# EAGLE design attiny_shield (EAGLE 8.3.2)
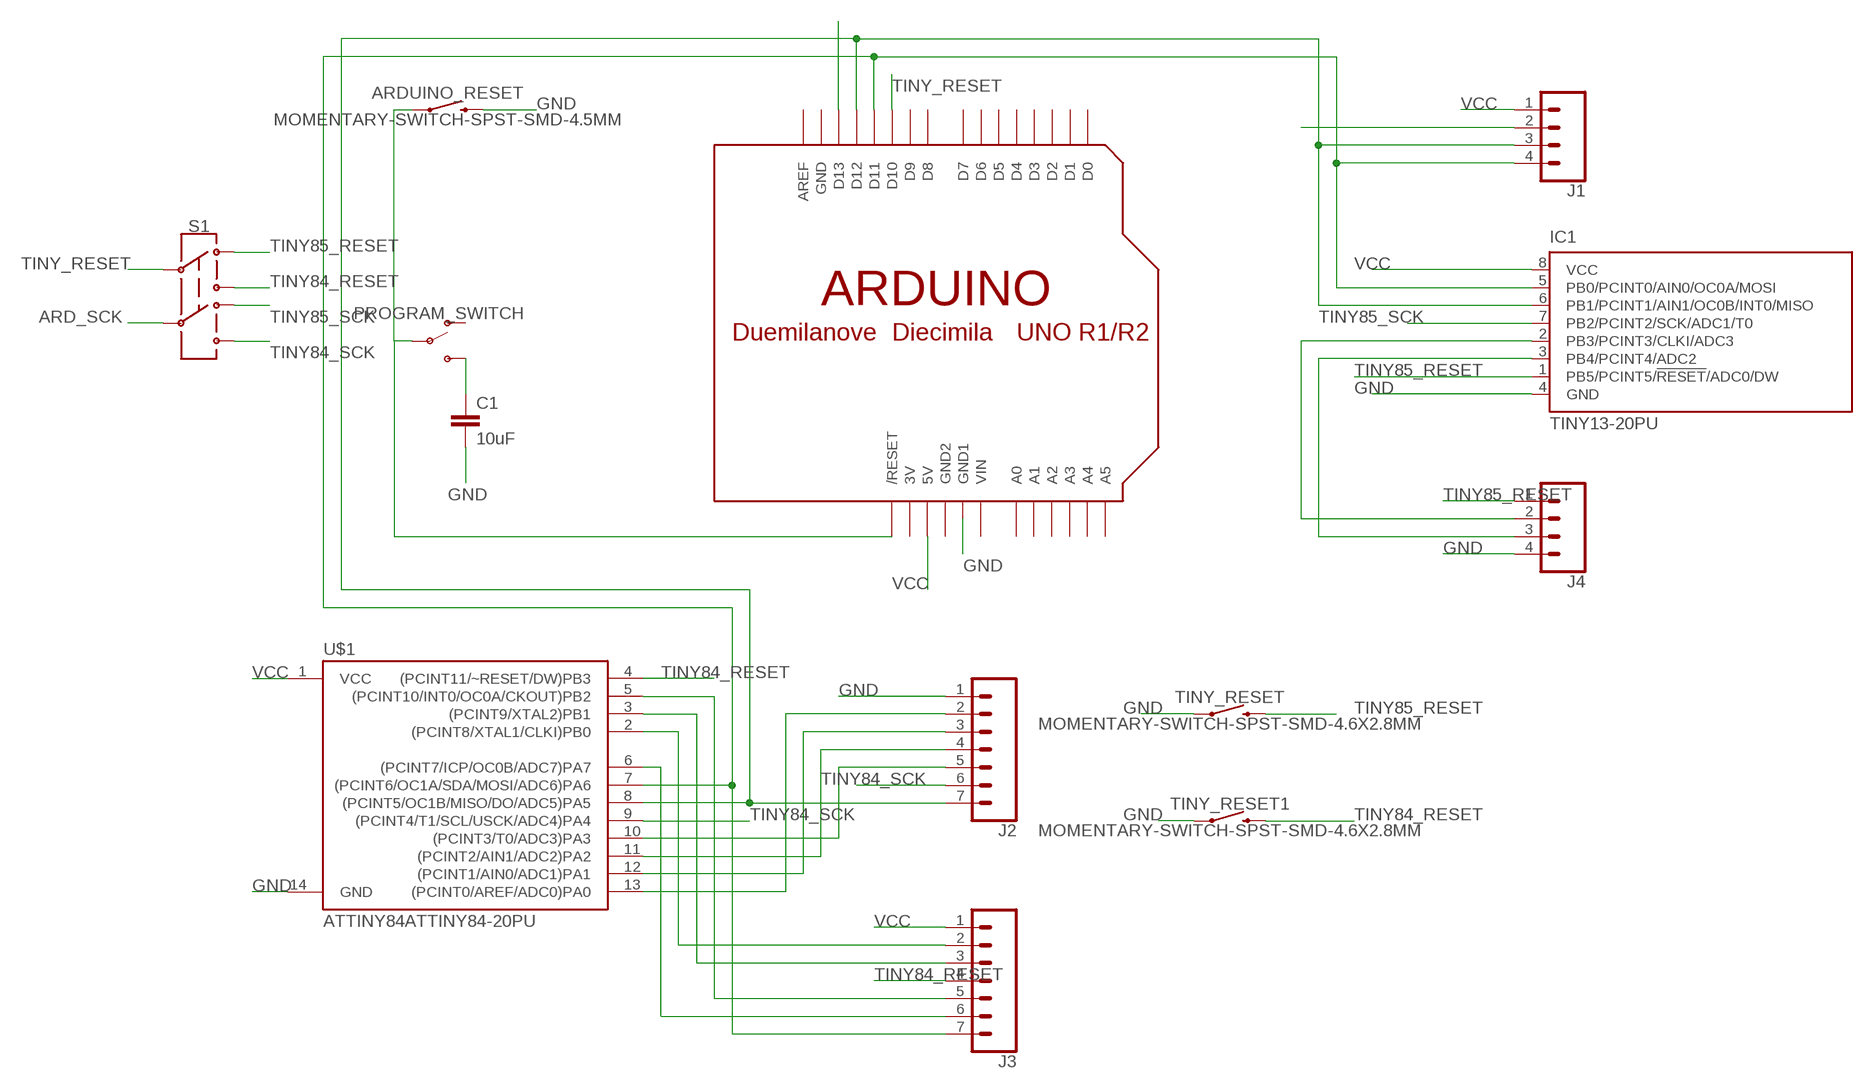
[diagram p0: schematic, sheet 1]

## Parts
ARDUINO_RESET  MOMENTARY-SWITCH-SPST-SMD-4.5MM  [TACTILE_SWITCH_SMD_4.5MM]
C1  10uF  10UF-0805-10V-10%  [0805]
IC1  TINY13-20PU  [DIL08]
J1  CONN_04  [1X04]
J2  CONN_07  [1X07]
J3  CONN_07  [1X07]
J4  CONN_04  [1X04]
PROGRAM_SWITCH  SWITCH-SPDT-SMD-AYZ0202  [SWITCH_DPDT_SMD_AYZ0202]
S1  SWITCH-DPDT-SMD-AYZ0202  [SWITCH_DPDT_SMD_AYZ0202]
TINY_RESET  MOMENTARY-SWITCH-SPST-SMD-4.6X2.8MM  [TACTILE_SWITCH_SMD_4.6X2.8MM]
TINY_RESET1  MOMENTARY-SWITCH-SPST-SMD-4.6X2.8MM  [TACTILE_SWITCH_SMD_4.6X2.8MM]
U$1  ATTINY84ATTINY84-20PU  [DIP14]
U$2  ARDUINO-NODIM  [ARDUINO-NODIM]

## Nets
84_0: J2.2 U$1.13((PCINT0/AREF/ADC0)PA0)
84_1: J2.3 U$1.12((PCINT1/AIN0/ADC1)PA1)
84_5: IC1.6(PB1/PCINT1/AIN1/OC0B/INT0/MISO) J1.3 J2.7 U$1.8((PCINT5/OC1B/MISO/DO/ADC5)PA5) U$2.D12
84_6: IC1.5(PB0/PCINT0/AIN0/OC0A/MOSI) J1.4 J3.7 U$1.7((PCINT6/OC1A/SDA/MOSI/ADC6)PA6) U$2.D11
ARD_SCK: S1.5 U$2.D13
GND: ARDUINO_RESET.1 ARDUINO_RESET.4 C1.2 IC1.4(GND) J2.1 J4.4 TINY_RESET1.1 TINY_RESET1.2 TINY_RESET.1 TINY_RESET.2 U$1.14(GND)
N$2: IC1.2(PB3/PCINT3/CLKI/ADC3) J4.2
N$3: IC1.3(PB4/PCINT4/ADC2) J4.3
N$9: C1.1 PROGRAM_SWITCH.3(S)
N$10: ARDUINO_RESET.2 ARDUINO_RESET.3 PROGRAM_SWITCH.2(P) U$2.RESET(/RESET)
N$14: J2.4 U$1.11((PCINT2/AIN1/ADC2)PA2)
N$15: J2.5 U$1.10((PCINT3/T0/ADC3)PA3)
N$17: J3.6 U$1.6((PCINT7/ICP/OC0B/ADC7)PA7)
N$18: J3.2 U$1.2((PCINT8/XTAL1/CLKI)PB0)
N$19: J3.3 U$1.3((PCINT9/XTAL2)PB1)
N$20: J3.5 U$1.5((PCINT10/INT0/OC0A/CKOUT)PB2)
TINY84_RESET: J3.4 S1.3 TINY_RESET1.3 TINY_RESET1.4 U$1.4((PCINT11/~RESET/DW)PB3)
TINY84_SCK: J2.6 S1.6 U$1.9((PCINT4/T1/SCL/USCK/ADC4)PA4)
TINY85_RESET: IC1.1(PB5/PCINT5/!RESET!/ADC0/DW) J4.1 S1.1 TINY_RESET.3 TINY_RESET.4
TINY85_SCK: IC1.7(PB2/PCINT2/SCK/ADC1/T0) J1.2 S1.4
TINY_RESET: S1.2 U$2.D10
VCC: IC1.8(VCC) J1.1 J3.1 U$1.1(VCC) U$2.5V
Unconnected: PROGRAM_SWITCH.1(O) U$2.A0 U$2.A1 U$2.A2 U$2.A3 U$2.A4 U$2.A5 U$2.AREF U$2.D0 U$2.D1 U$2.D2 U$2.D3 U$2.D4 U$2.D5 U$2.D6 U$2.D7 U$2.D8 U$2.D9

## Power pins joined to a net without a drawn wire
3V: U$2.3V
GND: U$2.GND
GND1: U$2.GND1
GND2: U$2.GND2
VIN: U$2.VIN

## Library data of the parts
ARDUINO_RESET = SparkFun-Switches:MOMENTARY-SWITCH-SPST: Momentary Switch (Pushbutton) - SPST Normally-open (NO) SPST momentary switches (buttons, pushbuttons). Variants PTH-12MM - 12mm square, through-hole Momentary Pushbutton Switch - 12mm Square <https://www.sparkfun.com/products/9190> (COM-09190) PTH-6.0MM, PTH-6.0MM-KIT - 6.0mm square, through-hole Mini Pushbutton Switch <https://www.sparkfun.com/products/97> (COM-00097) KIT package intended for soldering kit's - only one side of pads' copper is exposed. PTH-RIGHT-ANGLE-KIT - Right-angle, through-hole Right Angle Tactile Button <https://www.sparkfun.com/products/10791> - Used on SparkFun BigTime Watch Kit <https://www.sparkfun.com/products/11734> SMD-12MM - 12mm square, surface-mount Tactile Button - SMD (12mm) <https://www.sparkfun.com/products/12993> (COM-12993) Used on SparkFun PicoBoard <https://www.sparkfun.com/products/11888> SMD-4.5MM - 4.5mm Square Trackball Switch Used on SparkFun Blackberry Trackballer Breakout <https://www.sparkfun.com/products/13169> SMD-4.6MMX2.8MM - 4.60mm x 2.80mm, surface mount Used on SparkFun SAMD21 Mini Breakout <https://www.sparkfun.com/products/13664> SMD-5.2MM, SMD-5.2-REDUNDANT - 5.2mm square, surface-mount Mini Pushbutton Switch - SMD <https://www.sparkfun.com/products/8720> (COM-08720) Used on Arduino Pro Mini <https://www.sparkfun.com/products/11114> REDUNDANT package connects both switch circuits together SMD-6.0X3.5MM - 6.0 x 3.5mm, surface mount Momentary Reset Switch SMD <https://www.sparkfun.com/products/8229> (COM-08229) SMD-6.2MM-TALL - 6.2mm square, surface mount Tactile Button - SMD (6mm) <https://www.sparkfun.com/products/12992> Used on SparkFun Digital Sandbox <https://www.sparkfun.com/products/12651> SMD-RIGHT-ANGLE - Right-angle, surface mount Used on SparkFun Block for Intel® Edison - Arduino <https://www.sparkfun.com/products/13036>; PROD_ID: SWCH-09213
C1 = SparkFun-Capacitors:10UF: 10.0µF ceramic capacitors A capacitor is a passive two-terminal electrical component used to store electrical energy temporarily in an electric field.; PROD_ID: CAP-11330
IC1 = atmel:TINY13: 8-bit AVR Microcontroller with 1K Bytes In-System Programmable Flash Source: http://www.atmel.com/dyn/resources/prod_documents/2535S.pdf; MPN: ATTINY13-20PU; OC_FARNELL: 9171550; OC_NEWARK: 96K6521
J1 J4 = SparkFun-Connectors:CONN_04: Multi connection point. Often used as Generic Header-pin footprint for 0.1 inch spaced/style header connections On any of the 0.1 inch spaced packages, you can populate with these: Break Away Headers - Straight <https://www.sparkfun.com/products/116> (PRT-00116) Break Away Male Headers - Right Angle <https://www.sparkfun.com/products/553> (PRT-00553) Female Headers <https://www.sparkfun.com/products/115> (PRT-00115) Break Away Headers - Machine Pin <https://www.sparkfun.com/products/117> (PRT-00117) Break Away Female Headers - Swiss Machine Pin <https://www.sparkfun.com/products/743> (PRT-00743) For SCREWTERMINALS and SPRING TERMINALS visit here: Screw Terimnals on SparkFun.com <https://www.sparkfun.com/search/results?term=Screw+Terminals> (5mm/3.5mm/2.54mm spacing) This device is also useful as a general connection point to wire up your design to another part of your project. Our various solder wires solder well into these plated through hole pads. Hook-Up Wire - Assortment (Stranded, 22 AWG) <https://www.sparkfun.com/products/11375> (PRT-11375) Hook-Up Wire - Assortment (Solid Core, 22 AWG) <https://www.sparkfun.com/products/11367> (PRT-11367) View the entire wire category on our website here <https://www.sparkfun.com/categories/141> Special notes: Molex polarized connector foot print use with SKU : PRT-08231 with associated crimp pins and housings. 1MM SMD Version SKU: PRT-10208; PROD_ID: CONN-09696
J2 J3 = SparkFun-Connectors:CONN_07: Multi connection point. Often used as Generic Header-pin footprint for 0.1 inch spaced/style header connections On any of the 0.1 inch spaced packages, you can populate with these: Break Away Headers - Straight <https://www.sparkfun.com/products/116> (PRT-00116) Break Away Male Headers - Right Angle <https://www.sparkfun.com/products/553> (PRT-00553) Female Headers <https://www.sparkfun.com/products/115> (PRT-00115) Break Away Headers - Machine Pin <https://www.sparkfun.com/products/117> (PRT-00117) Break Away Female Headers - Swiss Machine Pin <https://www.sparkfun.com/products/743> (PRT-00743) For SCREWTERMINALS and SPRING TERMINALS visit here: Screw Terimnals on SparkFun.com <https://www.sparkfun.com/search/results?term=Screw+Terminals> (5mm/3.5mm/2.54mm spacing) This device is also useful as a general connection point to wire up your design to another part of your project. Our various solder wires solder well into these plated through hole pads. Hook-Up Wire - Assortment (Stranded, 22 AWG) <https://www.sparkfun.com/products/11375> (PRT-11375) Hook-Up Wire - Assortment (Solid Core, 22 AWG) <https://www.sparkfun.com/products/11367> (PRT-11367) View the entire wire category on our website here <https://www.sparkfun.com/categories/141> Special notes: Molex polarized connector foot print use with SKU : PRT-08231 with associated crimp pins and housings. 1MM SMD Version SKU: PRT-10208 NOTES ON THE VARIANTS LOCK and LOCK_LONGPADS... This footprint was designed to help hold the alignment of a through-hole component (i.e. 6-pin header) while soldering it into place. You may notice that each hole has been shifted either up or down by 0.005 of an inch from it's more standard position (which is a perfectly straight line). This slight alteration caused the pins (the squares in the middle) to touch the edges of the holes. Because they are alternating, it causes a "brace" to hold the component in place. 0.005 has proven to be the perfect amount of "off-center" position when using our standard breakaway headers. Although looks a little odd when you look at the bare footprint, once you have a header in there, the alteration is very hard to notice. Also,if you push a header all the way into place, it is covered up entirely on the bottom side.
PROGRAM_SWITCH = SparkFun-Switches:SWITCH-SPDT: Single Pole, Double Throw (SPDT) Switch Single-pole, double-throw (SPDT) switch. Variant Overview SMD-AYZ0202 Surface Mount DPDT Switch <https://www.sparkfun.com/products/597> (COM-00597) Used on e.g. LilyPad Arduino USB - ATmega32U4 Board <https://www.sparkfun.com/products/12049> PTH-11.6X4.0MM SPDT Mini Power Switch <https://www.sparkfun.com/products/102> (COM-00102) Used on e.g. SparkFun Simon Says - Through-Hole Soldering Kit <https://www.sparkfun.com/products/10547> (KIT-10547) PTH-11.6X4.0MM-KIT KIT version of SPDT Mini Power Switch - Simplifies soldering by removing tStop of switch pins - only one side can be soldered. PTH-11.6X4.0MM-LOCK LOCK version of SPDT Mini Power Switch - Offset pins hold switch in place for easier soldering. SMD-RIGHT-ANGLE Surface Mount Right Angle Switch <https://www.sparkfun.com/products/10860> (COM-10860) Used on e.g. SparkFun ESP8266 Thing <https://www.sparkfun.com/products/13231>; PROD_ID: SWCH-08179; SF_ID: COM-00597
S1 = SparkFun-Switches:SWITCH-DPDT: Double-Pole, Double-Throw (DPDT) Switch Double-pole, double-throw switches. Variant Overview PTH-GPI-152-3013 Used on SparkFun Geiger Counter <https://www.sparkfun.com/products/11345> SMD-AY0202 Surface Mount DPDT Switch <https://www.sparkfun.com/products/597> (COM-00597) Used on e.g. LilyPad Arduino USB - ATmega32U4 Board <https://www.sparkfun.com/products/12049>; PROD_ID: SWCH-08179; SF_SKU: COM-00597
TINY_RESET TINY_RESET1 = SparkFun-Switches:MOMENTARY-SWITCH-SPST: Momentary Switch (Pushbutton) - SPST Normally-open (NO) SPST momentary switches (buttons, pushbuttons). Variants PTH-12MM - 12mm square, through-hole Momentary Pushbutton Switch - 12mm Square <https://www.sparkfun.com/products/9190> (COM-09190) PTH-6.0MM, PTH-6.0MM-KIT - 6.0mm square, through-hole Mini Pushbutton Switch <https://www.sparkfun.com/products/97> (COM-00097) KIT package intended for soldering kit's - only one side of pads' copper is exposed. PTH-RIGHT-ANGLE-KIT - Right-angle, through-hole Right Angle Tactile Button <https://www.sparkfun.com/products/10791> - Used on SparkFun BigTime Watch Kit <https://www.sparkfun.com/products/11734> SMD-12MM - 12mm square, surface-mount Tactile Button - SMD (12mm) <https://www.sparkfun.com/products/12993> (COM-12993) Used on SparkFun PicoBoard <https://www.sparkfun.com/products/11888> SMD-4.5MM - 4.5mm Square Trackball Switch Used on SparkFun Blackberry Trackballer Breakout <https://www.sparkfun.com/products/13169> SMD-4.6MMX2.8MM - 4.60mm x 2.80mm, surface mount Used on SparkFun SAMD21 Mini Breakout <https://www.sparkfun.com/products/13664> SMD-5.2MM, SMD-5.2-REDUNDANT - 5.2mm square, surface-mount Mini Pushbutton Switch - SMD <https://www.sparkfun.com/products/8720> (COM-08720) Used on Arduino Pro Mini <https://www.sparkfun.com/products/11114> REDUNDANT package connects both switch circuits together SMD-6.0X3.5MM - 6.0 x 3.5mm, surface mount Momentary Reset Switch SMD <https://www.sparkfun.com/products/8229> (COM-08229) SMD-6.2MM-TALL - 6.2mm square, surface mount Tactile Button - SMD (6mm) <https://www.sparkfun.com/products/12992> Used on SparkFun Digital Sandbox <https://www.sparkfun.com/products/12651> SMD-RIGHT-ANGLE - Right-angle, surface mount Used on SparkFun Block for Intel® Edison - Arduino <https://www.sparkfun.com/products/13036>; PROD_ID: SWCH-13065
U$1 = SparkFun-IC-Microcontroller:ATTINY84: Atmel 14-pin 2/4/8kB flash uC Datasheet <https://cdn.sparkfun.com/datasheets/Widgets/doc8006.pdf> SparkFun Products Tiny AVR Programmer <https://www.sparkfun.com/products/11801> (PGM-11801) SparkFun Servo Trigger - Continuous Rotation <https://www.sparkfun.com/products/13872> (WIG-13872) SparkFun Servo Trigger <https://www.sparkfun.com/products/13118> (WIG-13118)
U$2 = adafruit:ARDUINO: Arduino Diecimila/Duemilanove Make a shield with ease, this package has all the named pins as well as the two mounting drill holes and an outline of the USB and DC power connector. The outline is on the DIMENSION layer, so if your board house uses it they will cut the outline to match. http://www.ladyada.net/library/pcb/eaglelibrary.html

## Board
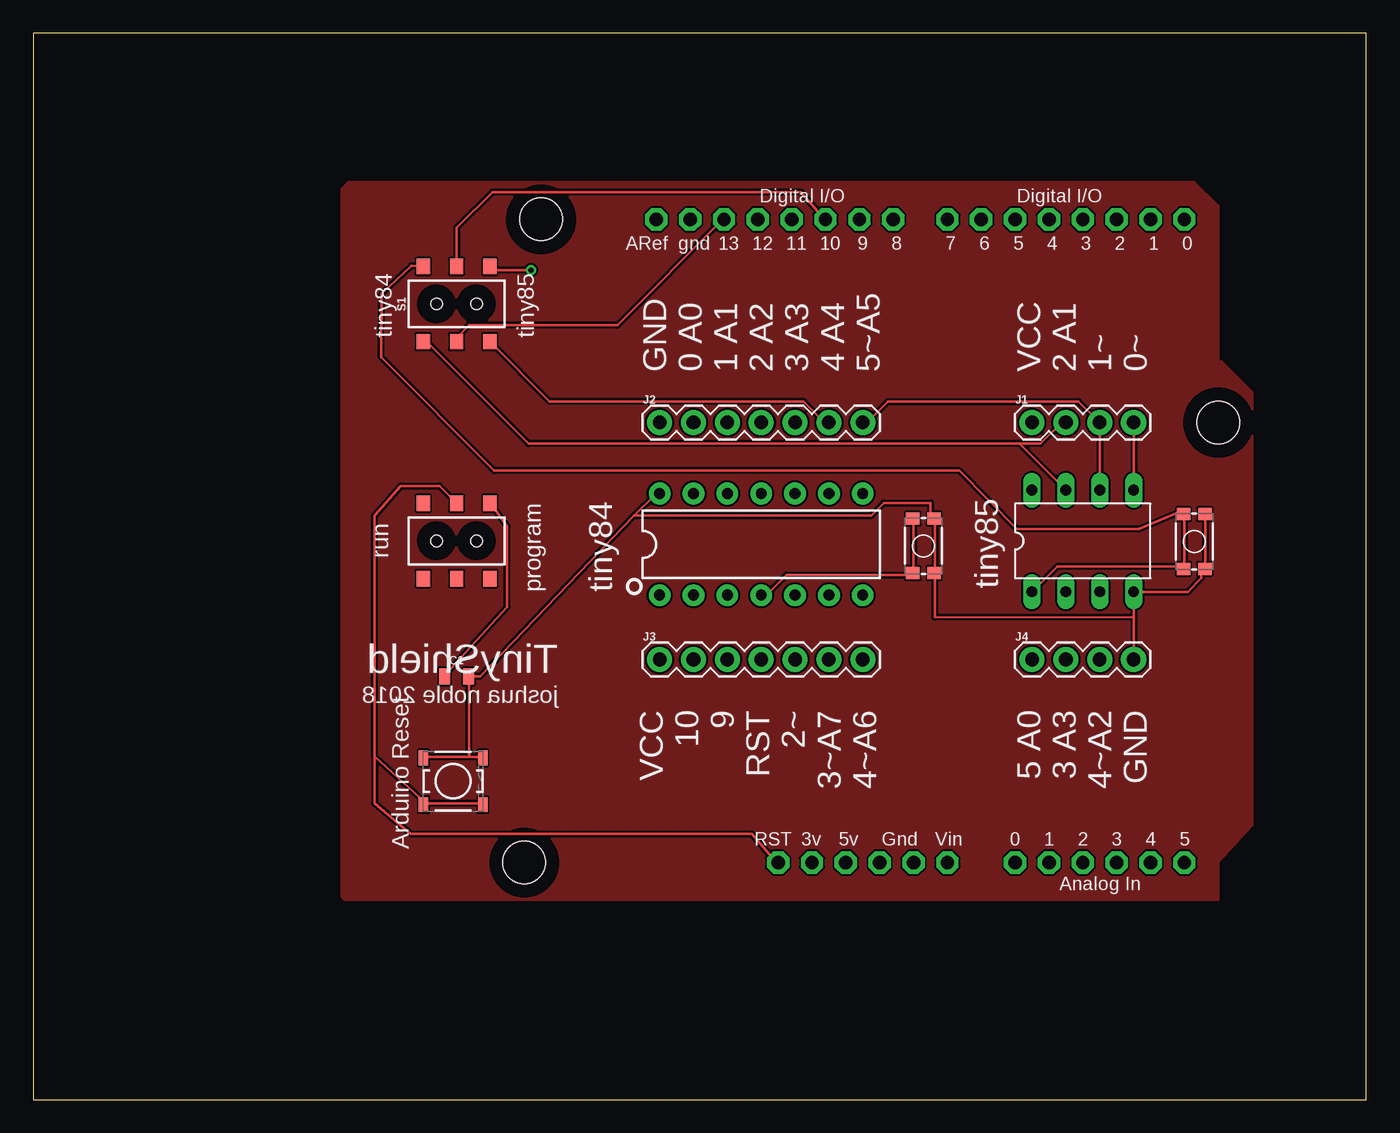
[diagram p1: board, top side]
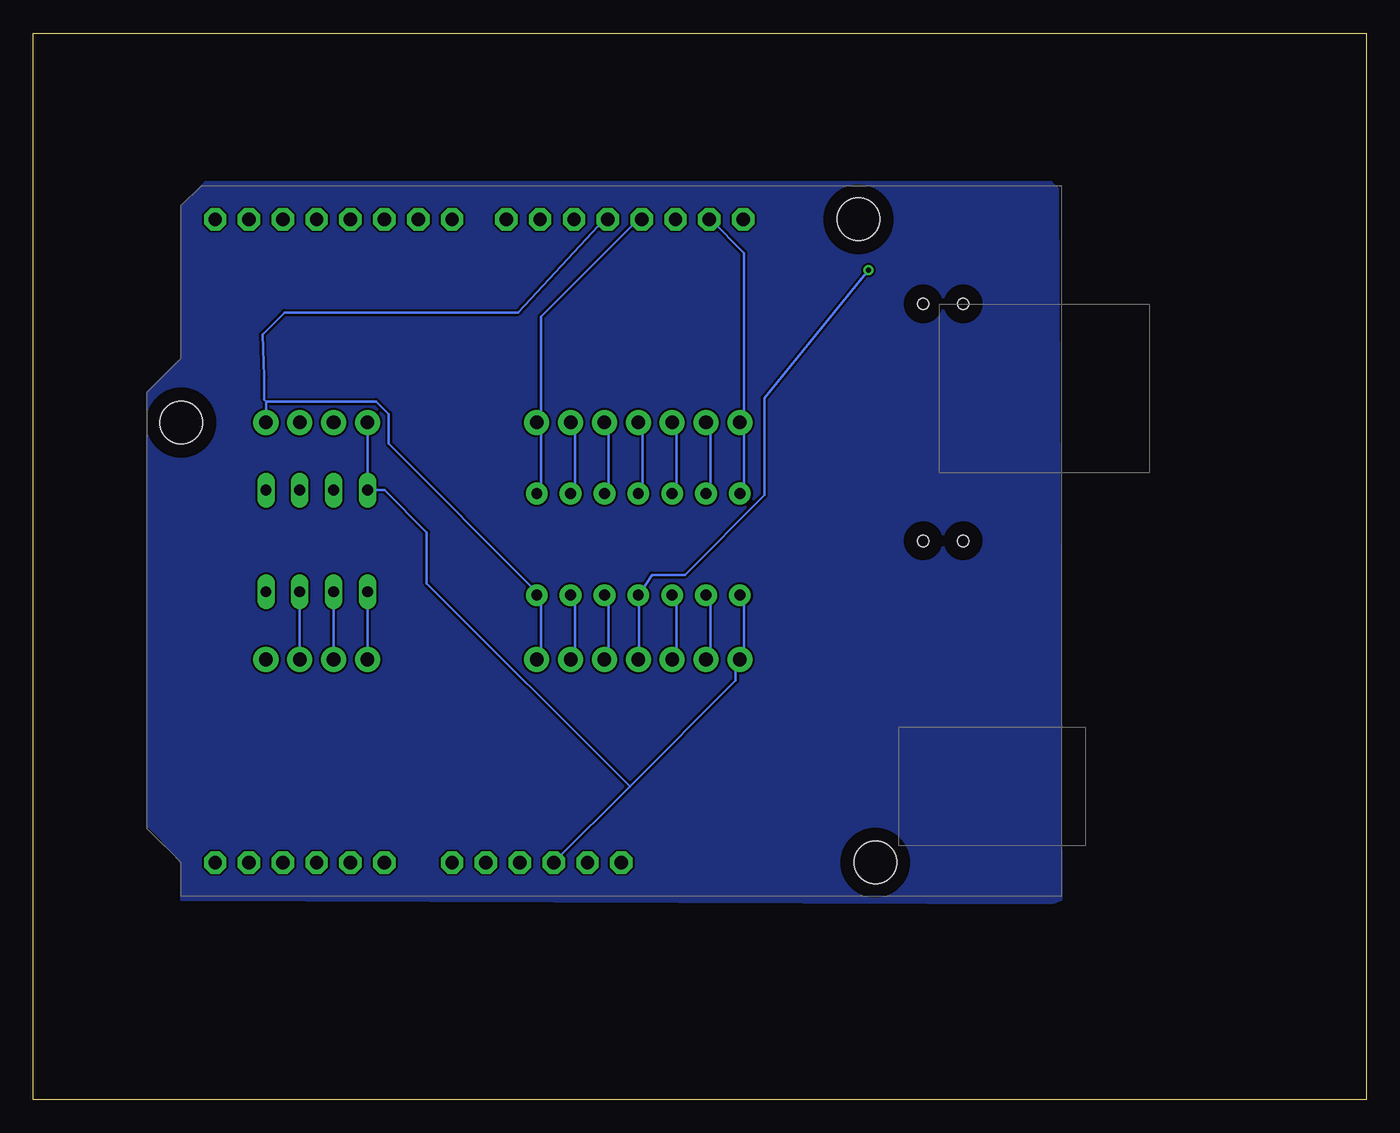
[diagram p2: board, bottom side, seen from below]

Size 100 x 80 mm. Coordinates in mm from the lower left corner, seen from the top.
Outline: 0,0 100,0 100,80 0,80 0,0
Copper layers (1*16): Top 0.035mm / dielectric 1.5mm / Bottom 0.035mm
Design rules "default": minimum track width 6mil, minimum drill 0.35mm, track to track 6mil, track to pad 6mil, pad to pad 6mil, via to via 6mil, smd to smd 6mil, copper to edge 40mil, drill to drill 6mil, minimum pad ring 10mil, minimum via ring 8mil, stop-mask expansion 4mil, vias tented up to drill 0mil, thermal gap 10mil

### Footprints (pad centres in the part's own frame; a part is rotated, then mirrored left to right if it is on the bottom)
TACTILE_SWITCH_SMD_4.5MM = smd 0.7 x 1.1: 1 2.225,1.75; 2 2.225,-1.75; 3 -2.225,-1.75; 4 -2.225,1.75
0805 = smd 0.8 x 1.2: 1 -0.9,0; 2 0.9,0
DIL08 = drill 0.813 long: 1 -3.81,-3.81; 2 -1.27,-3.81; 3 1.27,-3.81; 4 3.81,-3.81; 5 3.81,3.81; 6 1.27,3.81; 7 -1.27,3.81; 8 -3.81,3.81
1X04 = drill 1.016 pad 1.88: 1 0,0; 2 2.54,0; 3 5.08,0; 4 7.62,0
1X07 = drill 1.016 pad 1.88: 1 0,0; 2 2.54,0; 3 5.08,0; 4 7.62,0; 5 10.16,0; 6 12.7,0; 7 15.24,0
SWITCH_DPDT_SMD_AYZ0202 = smd 1 x 1.15: 1 -2.5,2.825; 2 0,2.825; 3 2.5,2.825; 4 -2.5,-2.825; 5 0,-2.825; 6 2.5,-2.825 | hole 0.85: 1.5,0; -1.5,0
TACTILE_SWITCH_SMD_4.6X2.8MM = smd 0.9 x 1: 1 -2.05,-0.8; 2 2.05,-0.8; 3 2.05,0.8; 4 -2.05,0.8
DIP14 = drill 0.813 pad 1.626: 1 -7.62,-3.81; 2 -5.08,-3.81; 3 -2.54,-3.81; 4 0,-3.81; 5 2.54,-3.81; 6 5.08,-3.81; 7 7.62,-3.81; 8 7.62,3.81; 9 5.08,3.81; 10 2.54,3.81; 11 0,3.81; 12 -2.54,3.81; 13 -5.08,3.81; 14 -7.62,3.81
ARDUINO-NODIM = drill 1 pad 1.676 octagon: 3V 35.56,2.54; 5V 38.1,2.54; A0 50.8,2.54; A1 53.34,2.54; A2 55.88,2.54; A3 58.42,2.54; A4 60.96,2.54; A5 63.5,2.54; AREF 23.876,50.8; D0 63.5,50.8; D1 60.96,50.8; D2 58.42,50.8; D3 55.88,50.8; D4 53.34,50.8; D5 50.8,50.8; D6 48.26,50.8; D7 45.72,50.8; D8 41.656,50.8; D9 39.116,50.8; D10 36.576,50.8; D11 34.036,50.8; D12 31.496,50.8; D13 28.956,50.8; GND 26.416,50.8; GND1 43.18,2.54; GND2 40.64,2.54; RESET 33.02,2.54; VIN 45.72,2.54 | hole 3.2: 15.24,50.8; 66.04,35.56; 13.97,2.54

### Placement (x,y rotation side)
ARDUINO_RESET  31.5,23.88 0 top
C1  31.75,31.75 0 top
IC1  78.74,41.91 0 top
J1  74.93,50.8 0 top
J2  46.99,50.8 0 top
J3  46.99,33.02 0 top
J4  74.93,33.02 0 top
PROGRAM_SWITCH  31.75,41.91 0 top
S1  31.75,59.69 0 top
TINY_RESET  87.1,41.87 90 top
TINY_RESET1  66.78,41.54 90 top
U$1  54.61,41.66 0 top
U$2  22.86,15.24 0 top

### Tracks (layer width: path | path; a pad name or v marks a point on that pad's centre or on a via)
84_0
  Bottom 0.203: J2.2 49.21,50.48 49.21,46.04 49.53,45.72 U$1.13
84_1
  Bottom 0.203: J2.3 51.75,50.48 51.75,46.04 52.07,45.72 U$1.12
84_5
  Top 0.203: IC1.6 J1.3 78.42,52.39 64.14,52.39 62.55,50.8 J2.7
  Bottom 0.203: 61.91,50.48 61.91,46.04 62.23,45.72 U$1.8 | 61.91,50.48 61.91,58.74 54.61,66.04 U$2.D12 | 61.91,50.48 J2.7
84_6
  Top 0.203: J1.4 IC1.5
  Bottom 0.203: J3.7 61.91,33.34 61.91,37.47 62.23,37.78 U$1.7 62.23,38.1 73.34,49.21 73.34,51.44 74.3,52.39 82.55,52.39 | J1.4 82.55,52.39 | 82.55,52.39 82.68,52.51 82.68,54.23 82.8,57.4 81.15,59.05 63.63,59.05 57.15,66.04 U$2.D11
ARD_SCK
  Top 0.203: S1.5 31.75,57.15 32.7,58.1 43.81,58.1 51.75,66.04 U$2.D13
GND
  Top 0.203: TINY_RESET.2 87.95,43.81 87.95,40.01 TINY_RESET.1 87.63,39.69 87.63,39.12 86.61,38.1 IC1.4 82.55,36.2 82.58,36.17 | 82.58,36.17 67.63,36.2 67.63,39.37 TINY_RESET1.1 67.63,39.69 67.63,43.5 TINY_RESET1.2 67.31,43.81 67.31,44.77 63.82,44.77 62.87,43.81 45.09,43.81 | 82.58,36.17 J4.4 | 32.7,25.72 33.66,25.72 ARDUINO_RESET.1 | 32.7,25.72 29.53,25.72 ARDUINO_RESET.4 | 32.7,25.72 32.7,31.75 | 32.7,31.75 33.53,31.75 45.09,43.81 | 45.09,43.81 46.67,45.4 46.99,45.4 U$1.14 | 32.7,31.75 C1.2
  Bottom 0.203: 46.67,50.48 46.67,46.04 46.99,45.72 U$1.14 | 46.67,50.48 46.67,63.5 49.21,66.04 U$2.GND | 46.67,50.48 J2.1
N$2
  Bottom 0.203: J4.2 IC1.2
N$3
  Bottom 0.203: J4.3 IC1.3
N$4
  pour Top: 23.62,68.83 87.12,68.83 88.9,67.06 88.9,55.37 89.15,55.37 91.44,53.09 91.44,20.57 88.9,17.78 88.9,14.99 23.37,14.99 23.11,15.24 23.11,68.33
  pour Bottom: 23.62,68.83 87.12,68.83 88.9,67.06 88.9,55.37 89.15,55.37 91.44,53.09 91.44,20.57 90.42,19.56 88.9,17.78 88.9,14.99 23.62,14.73 22.86,14.99 23.11,68.33
N$9
  Top 0.203: PROGRAM_SWITCH.3 34.29,44.45 34.37,44.65 35.56,43 35.56,36.96 30.92,31.88 30.8,31.75 C1.1
N$10
  Top 0.203: ARDUINO_RESET.2 33.66,22.23 29.53,22.23 ARDUINO_RESET.3 29.46,22.23 25.62,25.73 | 25.62,25.73 25.59,43.81 27.56,46.04 30.48,46.04 31.75,44.77 PROGRAM_SWITCH.2 | U$2.RESET 55.88,17.65 53.91,19.94 28.31,19.93 25.59,22.23 25.62,25.73
N$14
  Bottom 0.203: J2.4 54.29,50.48 54.29,46.04 54.61,45.72 U$1.11
N$15
  Bottom 0.203: J2.5 56.83,50.48 56.83,46.04 57.15,45.72 U$1.10
N$17
  Bottom 0.203: J3.6 59.37,33.34 59.37,37.47 59.69,37.78 U$1.6
N$18
  Bottom 0.203: J3.2 49.21,33.34 49.21,37.47 49.53,37.78 U$1.2
N$19
  Bottom 0.203: J3.3 51.75,33.34 51.75,37.47 52.07,37.78 U$1.3
N$20
  Bottom 0.203: J3.5 56.83,33.34 56.83,37.47 57.15,37.78 U$1.5
TINY84_RESET  (via drill 0.35)
  Top 0.203: TINY_RESET1.3 66.04,43.5 66.04,39.69 TINY_RESET1.4 65.72,39.37 56.52,39.37 55.24,38.1 54.61,38.1 U$1.4 | v37.34,62.23 34.29,62.23 S1.3
  Bottom 0.203: v37.34,62.23 45.15,52.64 45.15,45.34 51.12,39.37 53.59,39.37 54.48,37.97 54.55,37.66 | J3.4 54.55,33.08 54.55,37.66 | 54.55,37.66 U$1.4
TINY84_SCK
  Top 0.203: J2.6 59.37,50.8 57.78,52.39 38.73,52.39 34.29,56.83 S1.6
  Bottom 0.203: J2.6 59.37,50.48 59.37,46.04 59.69,45.72 U$1.9
TINY85_RESET
  Top 0.203: S1.1 29.21,62.55 28.38,62.58 26.14,60.46 26.11,55.72 34.57,47.18 69.47,47.18 73.79,42.8 82.93,42.8 86.04,44.13 TINY_RESET.3 86.36,43.81 86.36,40.01 TINY_RESET.4 86.04,40.01 76.83,40.01 IC1.1
  Bottom 0.203: J4.1 IC1.1
TINY85_SCK
  Top 0.203: 73.98,49.21 75.56,49.21 77.15,50.8 J1.2 | 73.98,49.21 37.15,49.21 29.53,56.83 S1.4 | 73.98,49.21 IC1.7
TINY_RESET
  Top 0.203: S1.2 31.76,65.42 34.45,68.1 57.59,68.1 59.37,66.04 U$2.D10
VCC
  Bottom 0.203: J1.1 IC1.8 73.66,45.72 70.48,42.55 70.48,38.73 55.24,23.5 | U$1.1 46.99,37.78 46.67,37.47 46.67,33.34 J3.1 47.31,32.7 47.31,31.43 55.24,23.5 | 55.24,23.5 U$2.5V

### Text on the board
tNames: tiny84 | tiny85 | GND / 0 A0 / 1 A1 / 2 A2 / 3 A3 / 4 A4 / 5~A5 | VCC / 2 A1 / 1~ / 0~ | run | program | tiny84 | tiny85 | TinyShield | joshua noble 2018 | VCC / 10 / 9 / RST / 2~ / 3~A7 / 4~A6 | 5 A0 / 3 A3 / 4~A2 / GND | Arduino Reset